# Altium schematic sheet B38_ESP32.SchDoc
size A4; SheetNumber: 2; SheetTotal: 11
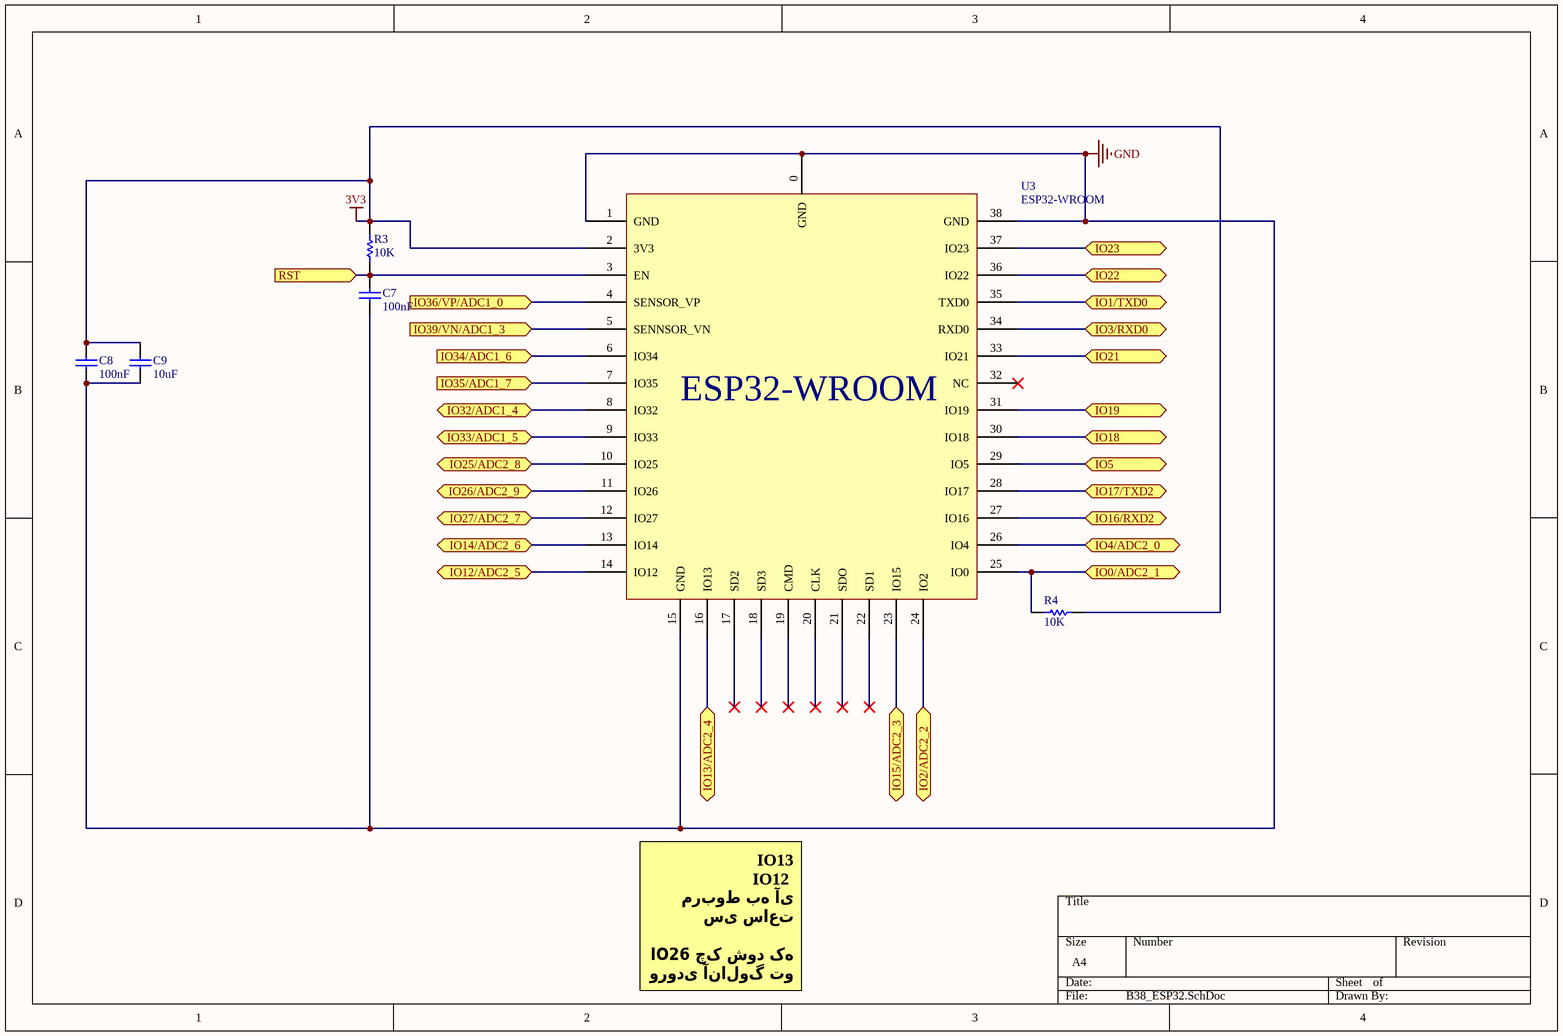
[diagram p0: B38_ESP32.SchDoc]

## Parts
C7  100nF  [CAP0603]
C8  100nF  [CAP0603]
C9  10uF  [CAP1206]
R3  10K  [RES0603]
R4  10K  [RES0603]
U3  ESP32-WROOM  [ESP32 WROOM]

## Ports
IO0/ADC2_1 (bidir), IO1/TXD0 (bidir), IO2/ADC2_2 (bidir), IO3/RXD0 (bidir), IO4/ADC2_0 (bidir), IO5 (bidir), IO12/ADC2_5 (bidir), IO13/ADC2_4 (bidir), IO14/ADC2_6 (bidir), IO15/ADC2_3 (bidir), IO16/RXD2 (bidir), IO17/TXD2 (bidir), IO18 (bidir), IO19 (bidir), IO21 (bidir), IO22 (bidir), IO23 (bidir), IO25/ADC2_8 (bidir), IO26/ADC2_9 (bidir), IO27/ADC2_7 (bidir), IO32/ADC1_4 (bidir), IO33/ADC1_5 (bidir), IO34/ADC1_6 (in), IO35/ADC1_7 (in), IO36/VP/ADC1_0 (in), IO39/VN/ADC1_3 (in), RST (in)

## Nets
3V3: C8.2 C9.2 R3.2 R4.2 U3.2(3V3)
GND: C7.1 C8.1 C9.1 U3.0(GND) U3.1(GND) U3.15(GND) U3.38(GND)
IO0/ADC2_1: R4.1 U3.25(IO0) ; port IO0/ADC2_1
IO1/TXD0: U3.35(TXD0) ; port IO1/TXD0
IO2/ADC2_2: U3.24(IO2) ; port IO2/ADC2_2
IO3/RXD0: U3.34(RXD0) ; port IO3/RXD0
IO4/ADC2_0: U3.26(IO4) ; port IO4/ADC2_0
IO5: U3.29(IO5) ; port IO5
IO12/ADC2_5: U3.14(IO12) ; port IO12/ADC2_5
IO13/ADC2_4: U3.16(IO13) ; port IO13/ADC2_4
IO14/ADC2_6: U3.13(IO14) ; port IO14/ADC2_6
IO15/ADC2_3: U3.23(IO15) ; port IO15/ADC2_3
IO16/RXD2: U3.27(IO16) ; port IO16/RXD2
IO17/TXD2: U3.28(IO17) ; port IO17/TXD2
IO18: U3.30(IO18) ; port IO18
IO19: U3.31(IO19) ; port IO19
IO21: U3.33(IO21) ; port IO21
IO22: U3.36(IO22) ; port IO22
IO23: U3.37(IO23) ; port IO23
IO25/ADC2_8: U3.10(IO25) ; port IO25/ADC2_8
IO26/ADC2_9: U3.11(IO26) ; port IO26/ADC2_9
IO27/ADC2_7: U3.12(IO27) ; port IO27/ADC2_7
IO32/ADC1_4: U3.8(IO32) ; port IO32/ADC1_4
IO33/ADC1_5: U3.9(IO33) ; port IO33/ADC1_5
IO34/ADC1_6: U3.6(IO34) ; port IO34/ADC1_6
IO35/ADC1_7: U3.7(IO35) ; port IO35/ADC1_7
IO36/VP/ADC1_0: U3.4(SENSOR_VP) ; port IO36/VP/ADC1_0
IO39/VN/ADC1_3: U3.5(SENNSOR_VN) ; port IO39/VN/ADC1_3
RST: C7.2 R3.1 U3.3(EN) ; port RST

Not connected (* = marked no-connect by the designer): U3 17(SD2)* 18(SD3)* 19(CMD)* 20(CLK)* 21(SDO)* 22(SD1)* 32(NC)*

## Notes on the sheet
- IO13
  IO12
  مربوط به آی سی ساعت
  IO26 چک شود که ورودی آنالوگ تو دیجیتال می باشد یا خیر؟

## Library data of the parts
C7 C8 = Cap: Capacitor; Published: 8-Jun-2000; Revision: July-2002: Re-released for DXP Platform.; Publisher: Altium Limited; Value: 100nF
C9 = Cap: Capacitor; Value: 100nF; Published: 8-Jun-2000; Revision: July-2002: Re-released for DXP Platform.; Publisher: Altium Limited
R3 R4 = Res1: Resistor 5%; Manufacturer: Panasonic; PN: ERJ3GEYJ101V; Value: 100Ω
U3 = ESP32-WROOM: ESP32 Wroom Module